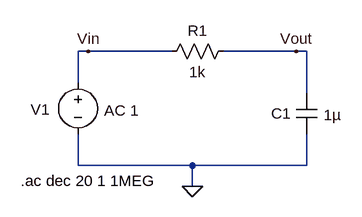
[diagram p0: schematic RC-low-pass-filter-01.asc]
RC-low-pass-filter-01.asc, the LTspice schematic file:
Version 4
SHEET 1 880 680
WIRE 16 80 0 80
WIRE 144 80 16 80
WIRE 336 80 224 80
WIRE 352 80 336 80
WIRE 0 128 0 80
WIRE 352 144 352 80
WIRE 0 256 0 208
WIRE 176 256 0 256
WIRE 352 256 352 208
WIRE 352 256 176 256
WIRE 176 288 176 256
FLAG 176 288 0
FLAG 16 80 Vin
FLAG 336 80 Vout
SYMBOL res 240 64 R90
WINDOW 0 0 56 VBottom 2
WINDOW 3 32 56 VTop 2
SYMATTR InstName R1
SYMATTR Value 1k
SYMBOL cap 336 144 R0
WINDOW 0 -39 32 Left 2
WINDOW 3 42 34 Left 2
SYMATTR InstName C1
SYMATTR Value 1µ
SYMBOL voltage 0 112 R0
WINDOW 0 -73 58 Left 2
WINDOW 3 41 56 Left 2
WINDOW 123 40 59 Left 2
WINDOW 39 0 0 Left 2
SYMATTR InstName V1
SYMATTR Value ""
SYMATTR Value2 AC 1
TEXT -88 280 Left 2 !.ac dec 20 1 1MEG

The netlist it stands for:
* RC-low-pass-filter-01.asc
R1 Vout Vin 1k
C1 Vout 0 1µ
V1 Vin 0 AC 1
.ac dec 20 1 1MEG
.backanno
.end